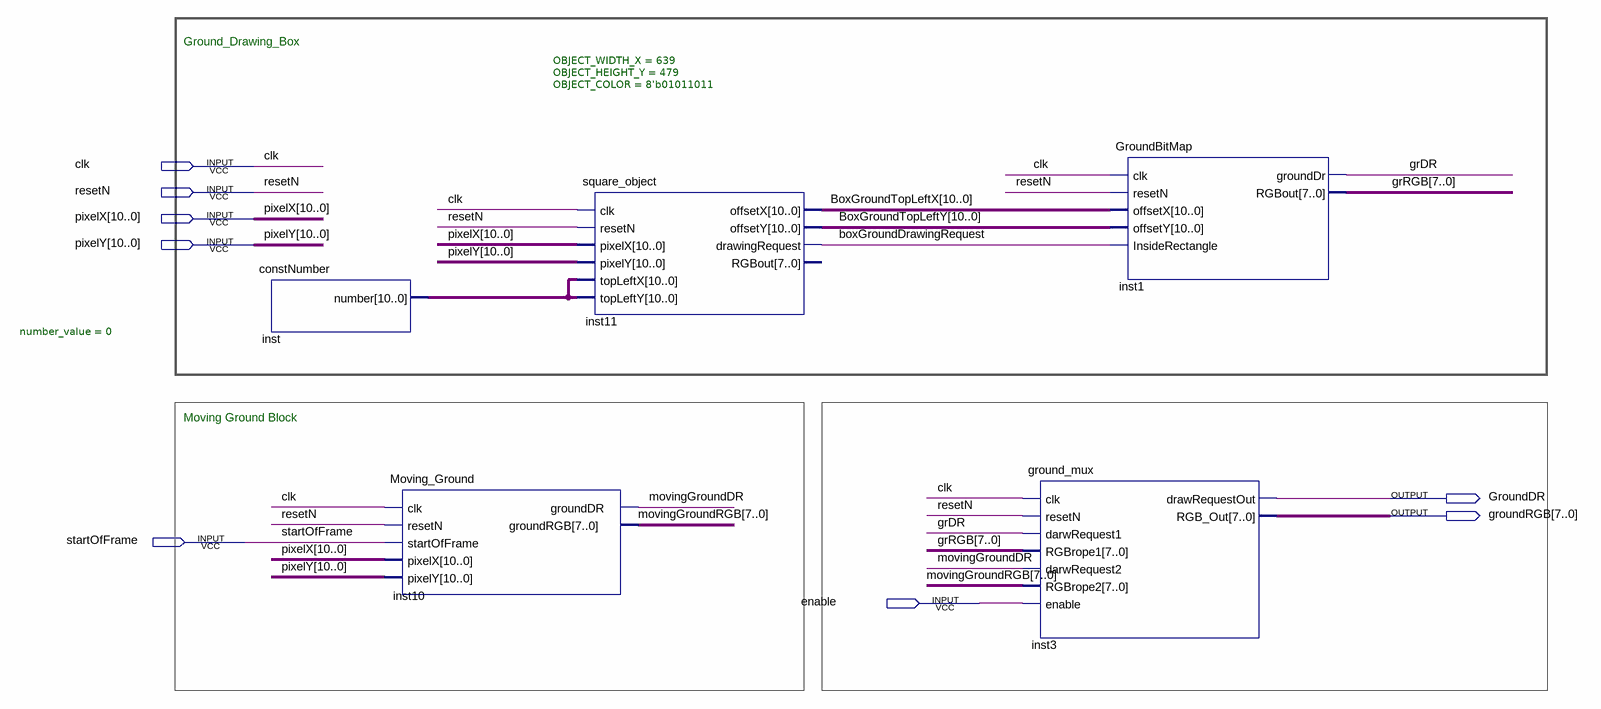
[diagram p0: schematic sheet]
// Quartus schematic GROUND_DISPLAY.bdf as structural Verilog: 5 symbols, 8 pins
module GROUND_DISPLAY (
  input  clk,
  input  resetN,
  input  [10:0] pixelX,
  input  [10:0] pixelY,
  input  startOfFrame,
  input  enable,
  output GroundDR,
  output [7:0] groundRGB
);

  wire boxGroundDrawingRequest, grDR, movingGroundDR;
  wire [7:0] grRGB, movingGroundRGB;
  wire [10:0] BoxGroundTopLeftX, BoxGroundTopLeftY, inst_number;

  constNumber #(.number_value(0)) inst (.number(inst_number));
  Moving_Ground inst10 (
    .clk(clk), .resetN(resetN), .startOfFrame(startOfFrame), .pixelX(pixelX), .pixelY(pixelY),
    .groundDR(movingGroundDR), .groundRGB(movingGroundRGB));
  square_object #(.OBJECT_WIDTH_X(639), .OBJECT_HEIGHT_Y(479), .OBJECT_COLOR(8'b01011011)) inst11 (
    .clk(clk), .resetN(resetN), .pixelX(pixelX), .pixelY(pixelY), .topLeftX(inst_number),
    .topLeftY(inst_number), .offsetX(BoxGroundTopLeftX), .offsetY(BoxGroundTopLeftY),
    .drawingRequest(boxGroundDrawingRequest));  // open: RGBout
  ground_mux inst3 (
    .clk(clk), .resetN(resetN), .darwRequest1(grDR), .RGBrope1(grRGB), .darwRequest2(movingGroundDR),
    .RGBrope2(movingGroundRGB), .enable(enable), .drawRequestOut(GroundDR), .RGB_Out(groundRGB));
  GroundBitMap inst1 (
    .clk(clk), .resetN(resetN), .offsetX(BoxGroundTopLeftX), .offsetY(BoxGroundTopLeftY),
    .InsideRectangle(boxGroundDrawingRequest), .groundDr(grDR), .RGBout(grRGB));

  // Notes on the sheet:
  //   Ground_Drawing_Box
  //   Moving Ground Block
endmodule
